# Altium project LM2596(CAN+%5V).PrjPcb
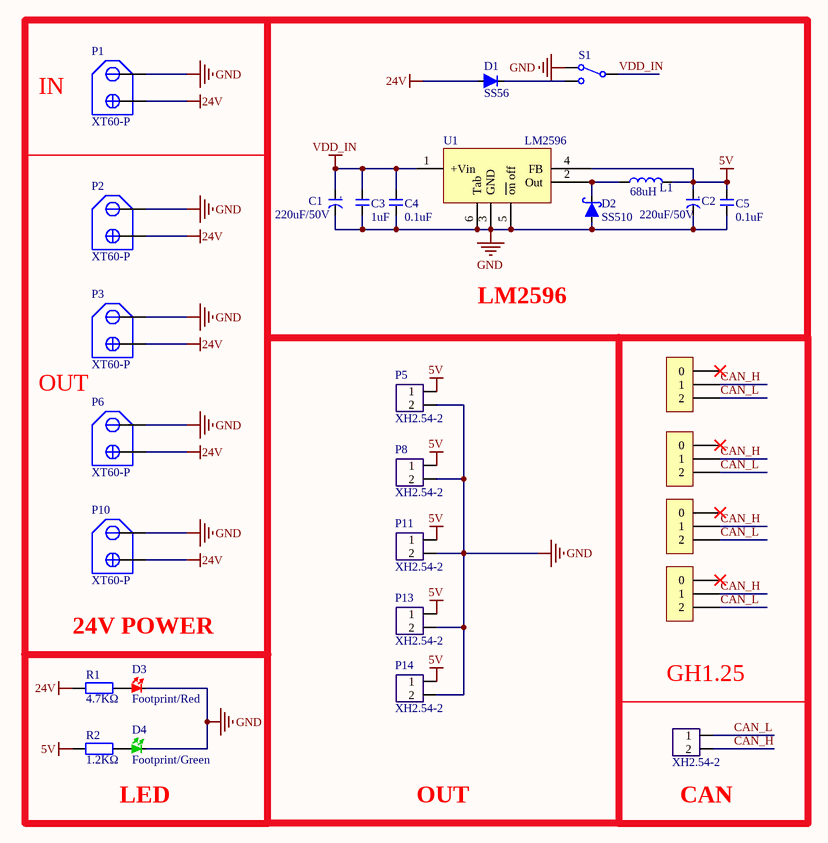
[diagram p0: demo V1.1.SchDoc]
1 sheet, 29 parts. Net scope: global (net labels, ports and power ports of the same name join across sheets).
Board file: demo V1.1.PcbDoc

## Sheet demo V1.1.SchDoc
size A4

### Parts
C1  Sch Name: 220uF/50V  [CAP Elec 5.0-10.0X20.0(φ0.6)]  (hidden comment: Device Name)
C2  Sch Name: 220uF/50V  [CAP Elec 5.0-10.0X20.0(φ0.6)]  (hidden comment: Device Name)
C3  Sch Name: 1uF  [CAP MLCC 0603]  (hidden comment: xxuF/xxV/Footprint)
C4  Sch Name: 0.1uF  [CAP MLCC 0603]  (hidden comment: xxuF/xxV/Footprint)
C5  Sch Name: 0.1uF  [CAP MLCC 0603]  (hidden comment: xxuF/xxV/Footprint)
D1  SS56  [DIODE SMA(DO-214AC)]
D2  SS510  [DIODE SMA(DO-214AC)]
D3  Sch Name: Footprint/Red  [LED_0805_R]  (hidden comment: Device Name)
D4  Sch Name: Footprint/Green  [LED_0805_G]  (hidden comment: Device Name)
L1  Sch Name: 68uH  [INDC SMDP 7447709(12X12X10)]  (hidden comment: Device Name)
P1  XT60-P  [XT60-P]
P2  XT60-P  [XT60-P]
P3  XT60-P  [XT60-P]
P4  BM02B-GHS-TBT  [JST BM02B-GHS-TBT]  (value not drawn)
P5  XH2.54-2  [XH2.54_2AW]
P6  XT60-P  [XT60-P]
P7  BM02B-GHS-TBT  [JST BM02B-GHS-TBT]  (value not drawn)
P8  XH2.54-2  [XH2.54_2AW]
P9  BM02B-GHS-TBT  [JST BM02B-GHS-TBT]  (value not drawn)
P10  XT60-P  [XT60-P]
P11  XH2.54-2  [XH2.54_2AW]
P12  BM02B-GHS-TBT  [JST BM02B-GHS-TBT]  (value not drawn)
P13  XH2.54-2  [XH2.54_2AW]
P14  XH2.54-2  [XH2.54_2AW]
P15  XH2.54-2  [XH2.54_2AW]
R1  4.7KΩ  [0603_R]
R2  1.2KΩ  [0603_R]
S1  Device Name  [SWITCH  Rocker 3-21.4x15]  (value not drawn)
U1  LM2596  [TO263-5]

### Nets
5V: C2.1 C5.2 L1.2 P5.1 P8.1 P11.1 P13.1 P14.1 R2.1 U1.4(FB)
24V: D1.1(A) P1.1(+) P2.1(+) P3.1(+) P6.1(+) P10.1(+) R1.1
GND: C1.2 C2.2 C3.1 C4.1 C5.1 D2.1(A) D3.2 D4.2 P1.2(-) P2.2(-) P3.2(-) P5.2 P6.2(-) P8.2 P10.2(-) P11.2 P13.2 P14.2 S1.3(NC) U1.3(GND) U1.5(~{on}_off) U1.6(Tab)
VDD_IN: C1.1 C3.2 C4.2 S1.1(COMMON) U1.1(+Vin)
CAN_H: P4.1 P7.1 P9.1 P12.1 P15.2
CAN_L: P4.2 P7.2 P9.2 P12.2 P15.1
NetD1_2: D1.2(C) S1.2(NO)
NetD2_2: D2.2(B) L1.1 U1.2(Out)
NetD3_1: D3.1 R1.2
NetD4_1: D4.1 R2.2

Not connected (* = marked no-connect by the designer): P4 0*; P7 0*; P9 0*; P12 0*

### Notes on the sheet
- IN
- LM2596
- OUT
- 24V POWER
- GH1.25
- LED
- (near P15) CAN
- (in symbol CAP Elec) +

### Library data of the parts
C1 C2 = CAP Elec: CAP Aluminum Electrolytic; Manufacture: Device Name
C3-C5 = CAP MLCC: Manufacture: xxuF/xxV/Footprint
D1 = Diode Rectifier: Manufacture: SS56; Sch Name: SS56
D2 = Diode Schottky: Manufacture: SS510; Sch Name: SS510
D3 = LED Red: Manufacture: Device Name
D4 = LED Green: Manufacture: Device Name
L1 = Inductor SMD Power: Manufacture: Device Name
P1-P3 P6 P10 = XT60-P: XT Connector; Manufacture: XT60-P; Sch Name: XT60-P
P4 P7 P9 P12 = JST BM02B-GHS-TBT: Manufacture: BM02B-GHS-TBT
R1 = 0603 4.7KΩ (4701) 1%: 贴片电阻; ComponentLink1Description: 供应商链接; ComponentLink1URL: http://www.szlcsc.com/product/details_23889.html; Package: 0603; Supplier: LC; SuppliersPartNumber: C23162
R2 = 0603 1.2KΩ (1201) 1%: 贴片电阻; ComponentLink1Description: 供应商链接; ComponentLink1URL: http://www.szlcsc.com/product/details_23492.html; Package: 0603; Supplier: LC; SuppliersPartNumber: C22765
S1 = Switch Rocker: 船型开关; Manufacture: Device Name
P5 P8 P11 P13-P15 = XH2.54-2: Manufacture: XH2.54-2; Sch Name: XH2.54-2